# EasyEDA Pro project MAX5864_REUSE.eprj, schematic Schematic1
Create Date: 2024-10-05; Page Name: P1; Project Name: MAX5864_REUSE; Schematic Name: Schematic1; Update Date: 2024-11-04; Company: EasyEDA.com; Drawn: EasyEDA; Page Size: A4; Part Number: JLCPCB-002; Reviewed: EasyEDA; Version: V0.1
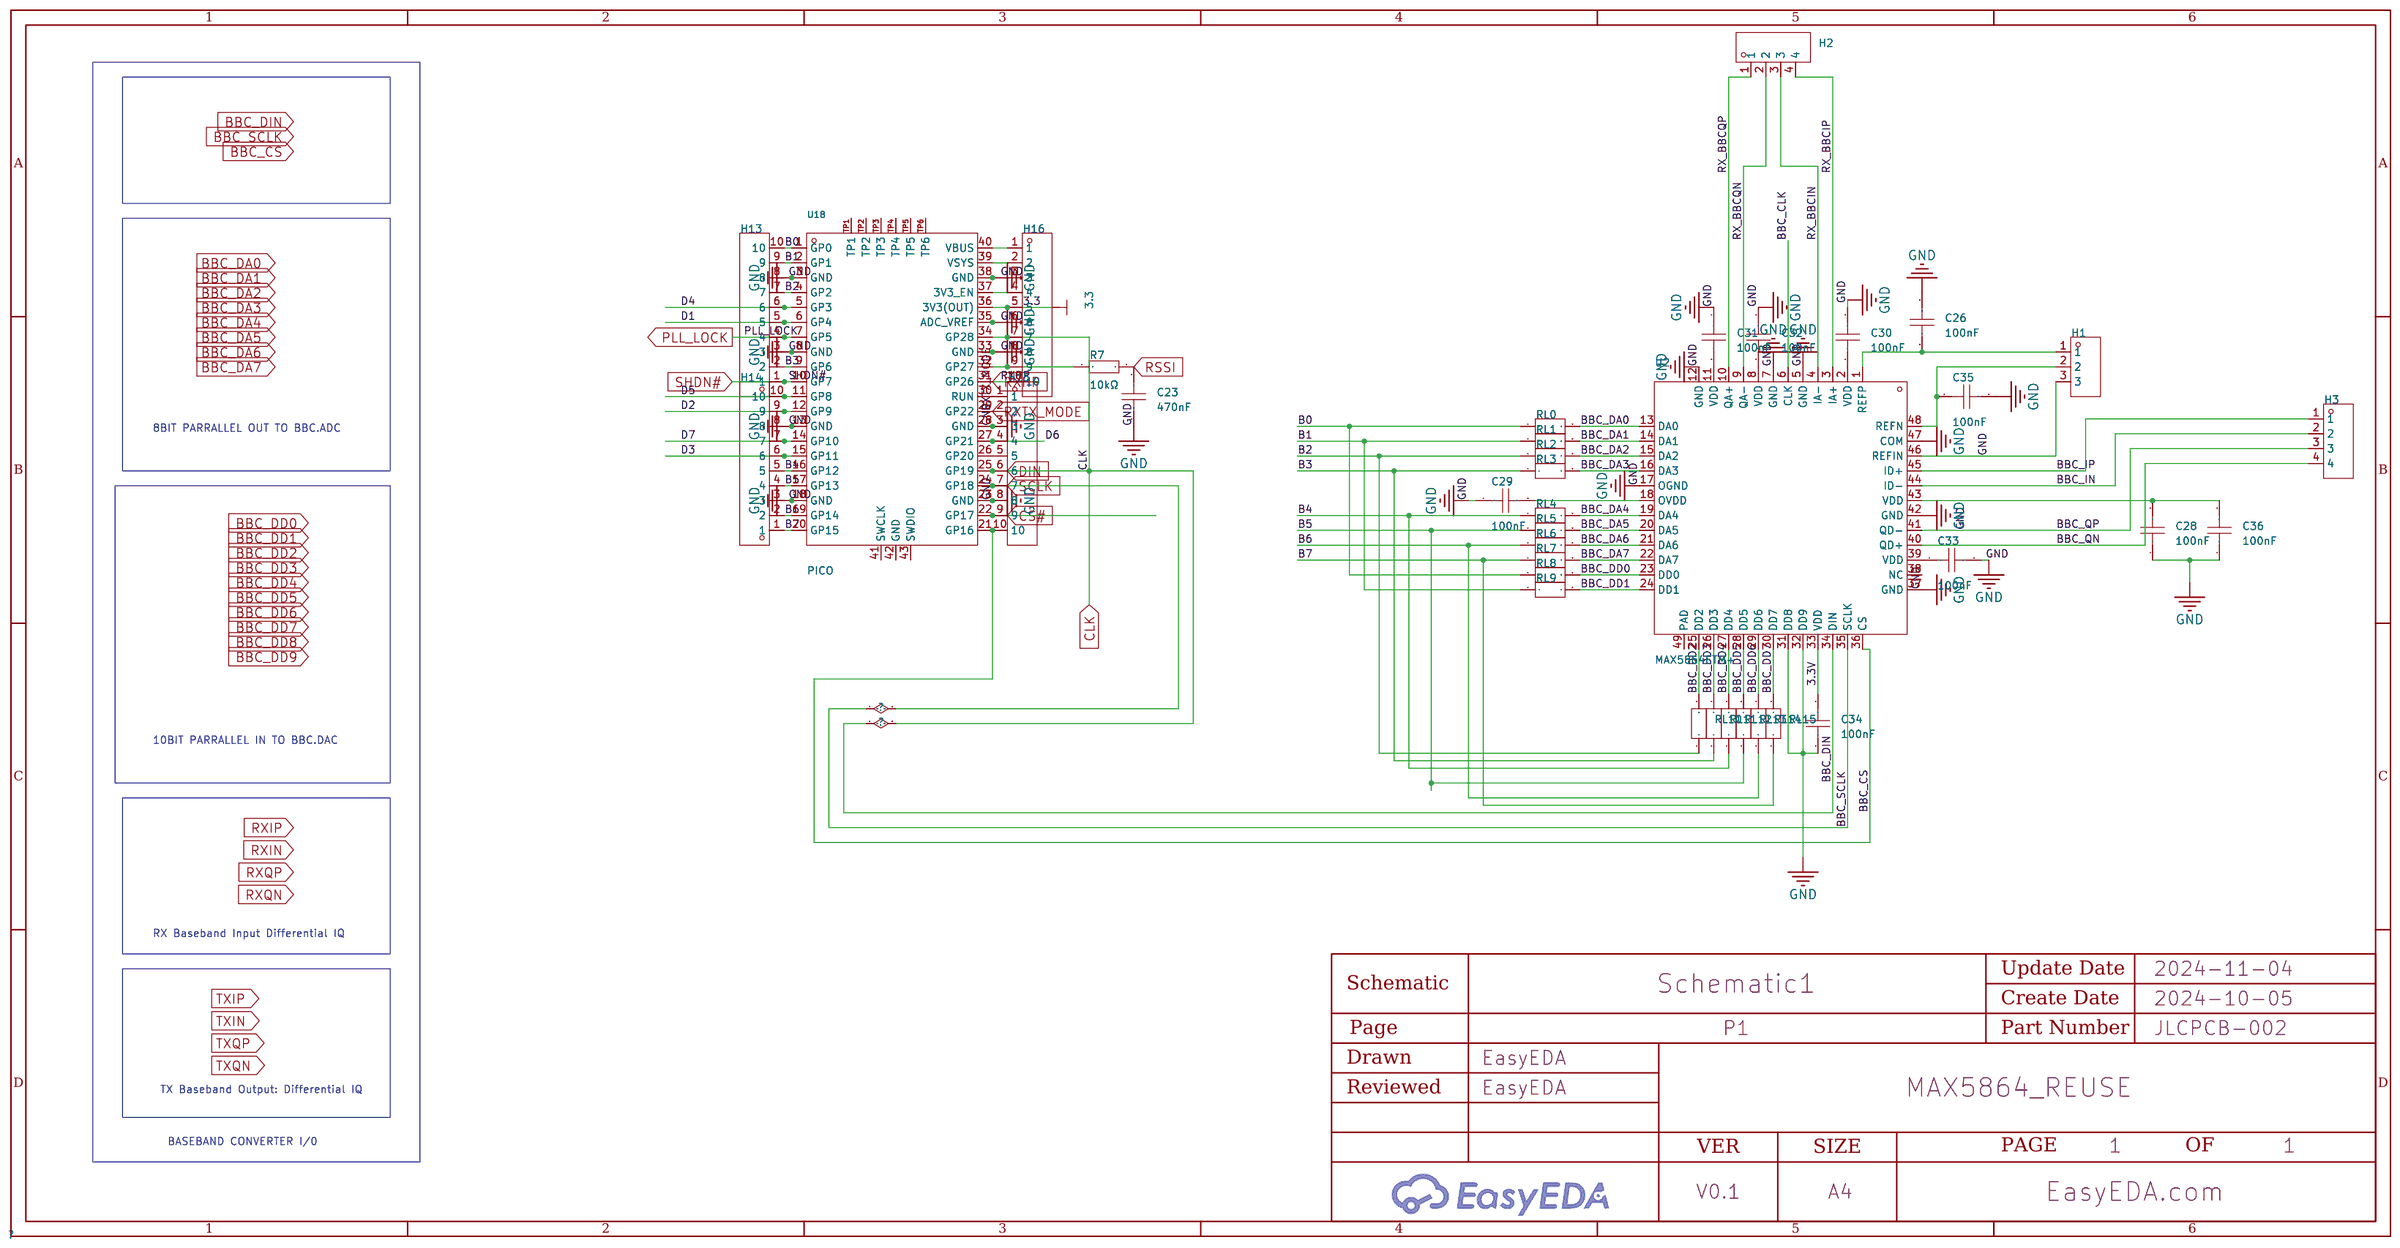
[diagram p0: schematic sheet]

## Parts
C23  470nF  [CAP-TH_L7.2-W2.5-P5.00-D0.5]
C26  100nF  [C0805]
C28  100nF  [C0805]
C29  100nF  [C0805]
C30  100nF  [C0805]
C31  100nF  [C0805]
C32  100nF  [C0805]
C33  100nF  [C0805]
C34  100nF  [C0805]
C35  100nF  [C0805]
C36  100nF  [C0805]
H1  -  [HDR-TH_3P-P2.54-V-M]
H2  -  [HDR-TH_4P-P2.54-V-M]
H3  -  [HDR-TH_4P-P2.54-V-M]
H13  -  [HDR-TH_10P-P2.54-V-F]
H14  -  [HDR-TH_10P-P2.54-V-F]
H15  -  [HDR-TH_10P-P2.54-V-F]
H16  -  [HDR-TH_10P-P2.54-V-F]
R7  10kΩ  [RES-TH_BD1.8-L3.2-P7.20-D0.4]
RL0  PFC-W0805LF-03-1301-B  [R0805]
RL1  PFC-W0805LF-03-1301-B  [R0805]
RL2  PFC-W0805LF-03-1301-B  [R0805]
RL3  PFC-W0805LF-03-1301-B  [R0805]
RL4  PFC-W0805LF-03-1301-B  [R0805]
RL5  PFC-W0805LF-03-1301-B  [R0805]
RL6  PFC-W0805LF-03-1301-B  [R0805]
RL7  PFC-W0805LF-03-1301-B  [R0805]
RL8  PFC-W0805LF-03-1301-B  [R0805]
RL9  PFC-W0805LF-03-1301-B  [R0805]
RL10  PFC-W0805LF-03-1301-B  [R0805]
RL11  PFC-W0805LF-03-1301-B  [R0805]
RL12  PFC-W0805LF-03-1301-B  [R0805]
RL13  PFC-W0805LF-03-1301-B  [R0805]
RL14  PFC-W0805LF-03-1301-B  [R0805]
RL15  PFC-W0805LF-03-1301-B  [R0805]
U2  MAX5864ETM+  [QFN-48_L7.0-W7.0-P0.50-BL-EP5.1]
U18  PICO  [COMM-SMD_L51.0-W21.0-P2.54_SC0916]

## Library data of the parts
C23 = C241J474J20C000: Capacitance:470nF Tolerance:±5% Tolerance:±5% Voltage Rated: Dielectric Material:Metallized Polyester Film Capacitor Operating Temperature:-55℃~+125℃ Operating Temperature:-55℃~+125℃; LCSC Part Name: 470nF ±5% 63V; Supplier Part: C5121927; Manufacturer: faratronic(厦门法拉); Supplier Footprint: 插件,P=5mm; JLCPCB Part Class: Extended Part; Datasheet: https://atta.szlcsc.com/upload/public/pdf/source/20220309/53E9D6585E584592026F1B9FCED89B93.pdf; Supplier: LCSC; Tolerance: ±5%; Dielectric Material: Metallized Polyester Film Capacitor; Operating Temperature: -55℃~+125℃
C26 C28-C36 = CAP_0805: Supplier Footprint: 0805
H1 = HDR-M_2.54_1x3P: Supplier Footprint: Through
H2 H3 = HDR-M_2.54_1x4P: Supplier Footprint: Through
H13-H16 = HDR-F_2.54_1x10P: Supplier Footprint: Through
R7 = Res_AXIAL-1/8W: Supplier Footprint: Through
RL0-RL15 = PFC-W0805LF-03-1301-B: Supplier Part: C22384601; JLCPCB Part Class: Extended Part; Supplier: LCSC
U2 = MAX5864ETM+: Supply Voltage:2.7V~3.3V Supply Voltage:2.7V~3.3V; LCSC Part Name: MAX5864ETM; Supplier Part: C143525; Manufacturer: ADI(亚德诺)/MAXIM(美信); Supplier Footprint: QFN-48-EP(7x7); JLCPCB Part Class: Extended Part; Datasheet: https://atta.szlcsc.com/upload/public/pdf/source/20171204/C143525_15123772477351162683.pdf; Supplier: LCSC; Supply Voltage: 2.7V~3.3V
U18 = PICO: Supplier Part: C7203002; Manufacturer: Raspberry Pi(树莓派); JLCPCB Part Class: Extended Part; Datasheet: https://atta.szlcsc.com/upload/public/pdf/source/20230906/086376002DDC9866828648BC93E51F8B.pdf; Supplier: LCSC

## Nets
3.3V: C34.1 U2.33(VDD)
GND: C23.1 C26.1 C28.1 C29.1 C30.2 C31.1 C32.1 C33.2 C34.2 C35.2 C36.1 H13.3 H13.8 H14.3 H14.8 H15.3 H15.8 H16.3 H16.6 H16.8 U2.5(GND) U2.7(GND) U2.12(GND) U2.17(OGND) U2.31(DD8) U2.32(DD9) U2.37(GND) U2.42(GND) U2.47(COM) U18.3(GND) U18.8(GND) U18.13(GND) U18.18(GND) U18.23(GND) U18.28(GND) U18.33(GND) U18.35(ADC_VREF) U18.38(GND)
3.3: H16.5 U18.36(3V3(OUT))
B0: H13.10 RL0.1 RL8.1 U18.1(GP0)
B1: H13.9 RL1.1 RL9.1 U18.2(GP1)
B2: H13.7 RL2.1 RL10.1 U18.4(GP2)
B3: H13.2 RL3.1 RL11.1 U18.9(GP6)
B4: H14.5 RL4.1 RL12.1 U18.16(GP12)
B5: H14.4 RL5.1 RL13.1 U18.17(GP13)
B6: H14.2 RL6.1 RL14.1 U18.19(GP14)
B7: H14.1 RL7.1 RL15.1 U18.20(GP15)
BBC_CLK: U2.6(CLK)
BBC_CS: H15.10 U2.36(CS) U18.21(GP16)
BBC_DA0: RL0.2 U2.13(DA0)
BBC_DA1: RL1.2 U2.14(DA1)
BBC_DA2: RL2.2 U2.15(DA2)
BBC_DA3: RL3.2 U2.16(DA3)
BBC_DA4: RL4.2 U2.19(DA4)
BBC_DA5: RL5.2 U2.20(DA5)
BBC_DA6: RL6.2 U2.21(DA6)
BBC_DA7: RL7.2 U2.22(DA7)
BBC_DD0: RL8.2 U2.23(DD0)
BBC_DD1: RL9.2 U2.24(DD1)
BBC_DD2: RL10.2 U2.25(DD2)
BBC_DD3: RL11.2 U2.26(DD3)
BBC_DD4: RL12.2 U2.27(DD4)
BBC_DD5: RL13.2 U2.28(DD5)
BBC_DD6: RL14.2 U2.29(DD6)
BBC_DD7: RL15.2 U2.30(DD7)
BBC_DIN: H15.6 U2.34(DIN) U18.25(GP19)
BBC_IN: H3.2 U2.44(ID-)
BBC_IP: H3.1 U2.45(ID+)
BBC_QN: H3.4 U2.40(QD+)
BBC_QP: H3.3 U2.41(QD-)
BBC_SCLK: H15.7 U2.35(SCLK) U18.24(GP18)
CLK: H16.7 U18.34(GP28)
CS#: H15.9 U18.22(GP17)
D1: H13.5 U18.6(GP4)
D2: H14.9 U18.12(GP9)
D3: H14.6 U18.15(GP11)
D4: H13.6 U18.5(GP3)
D5: H14.10 U18.11(GP8)
D6: H15.4 U18.27(GP21)
D7: H14.7 U18.14(GP10)
PLL_LOCK: H13.4 U18.7(GP5)
RSSI: C23.2 R7.2
RX_BBCIN: H2.3 U2.4(IA-)
RX_BBCIP: H2.4 U2.3(IA+)
RX_BBCQN: H2.2 U2.9(QA-)
RX_BBCQP: H2.1 U2.10(QA+)
RXHP: H16.10 U18.31(GP26)
RXTX_MODE: H15.2 U18.29(GP22)
SHDN#: H13.1 U18.10(GP7)
$1N1830: C30.1 U2.2(VDD)
$1N1839: C29.2 U2.18(OVDD)
$1N3073: C26.2 H1.1 U2.1(REFP)
$1N3079: C35.1 H1.2 U2.48(REFN)
$1N3085: H1.3 U2.46(REFIN)
$1N3266: C28.2 C36.2 U2.43(VDD)
$1N3998: C31.2 U2.11(VDD)
$1N4024: C32.2 U2.8(VDD)
$1N4050: C33.1 U2.39(VDD)
$1N9676: H15.1 U18.30(RUN)
$1N9679: H15.5 U18.26(GP20)
$1N9682: H16.2 U18.39(VSYS)
$1N9686: H16.9 R7.1 U18.32(GP27)
$1N9692: H16.1 U18.40(VBUS)
$1N9693: H16.4 U18.37(3V3_EN)

Not connected (* = marked no-connect by the designer): U2 38(NC) 49(PAD); U18 41(SWCLK) 42(GND) 43(SWDIO) TP1 TP2 TP3 TP4 TP5 TP6

## Notes on the sheet
- 8BIT PARRALLEL OUT TO BBC.ADC
- 10BIT PARRALLEL IN TO BBC.DAC
- RX Baseband Input Differential IQ
- TX Baseband Output: Differential IQ
- BASEBAND CONVERTER I/0
